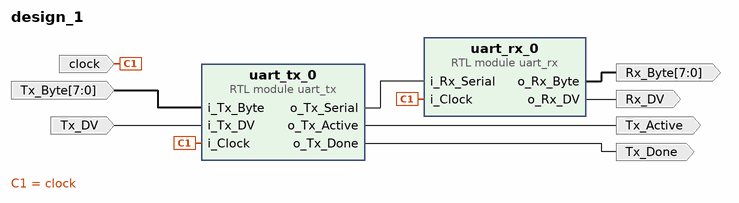
[diagram p0: block diagram of the top level]
# Vivado block design design_1, xc7a100tcsg324-1, Vivado 2023.1
create_bd_design design_1

create_bd_port -dir I clock
create_bd_port -dir I Tx_DV
create_bd_port -dir I -from 7 -to 0 Tx_Byte
create_bd_port -dir O Tx_Active
create_bd_port -dir O Tx_Done
create_bd_port -dir O Rx_DV
create_bd_port -dir O -from 7 -to 0 Rx_Byte

create_bd_cell -type module -reference uart_rx uart_rx_0
set_property -dict {CONFIG.CLKS_PER_BIT 87} [get_bd_cells uart_rx_0]
create_bd_cell -type module -reference uart_tx uart_tx_0
set_property -dict {CONFIG.CLKS_PER_BIT 87} [get_bd_cells uart_tx_0]

# ---- connections ----

connect_bd_net [get_bd_ports Tx_Byte] [get_bd_pins uart_tx_0/i_Tx_Byte]
connect_bd_net [get_bd_ports Tx_DV] [get_bd_pins uart_tx_0/i_Tx_DV]
connect_bd_net -net r_clock_1 [get_bd_ports clock] [get_bd_pins uart_rx_0/i_Clock] [get_bd_pins uart_tx_0/i_Clock]
connect_bd_net [get_bd_pins uart_rx_0/o_Rx_Byte] [get_bd_ports Rx_Byte]
connect_bd_net [get_bd_pins uart_rx_0/o_Rx_DV] [get_bd_ports Rx_DV]
connect_bd_net [get_bd_pins uart_tx_0/o_Tx_Active] [get_bd_ports Tx_Active]
connect_bd_net [get_bd_pins uart_tx_0/o_Tx_Done] [get_bd_ports Tx_Done]
connect_bd_net [get_bd_pins uart_tx_0/o_Tx_Serial] [get_bd_pins uart_rx_0/i_Rx_Serial]

validate_bd_design
save_bd_design
